# Altium schematic sheet Sheet_1.schdoc
size 328 x 230 mm
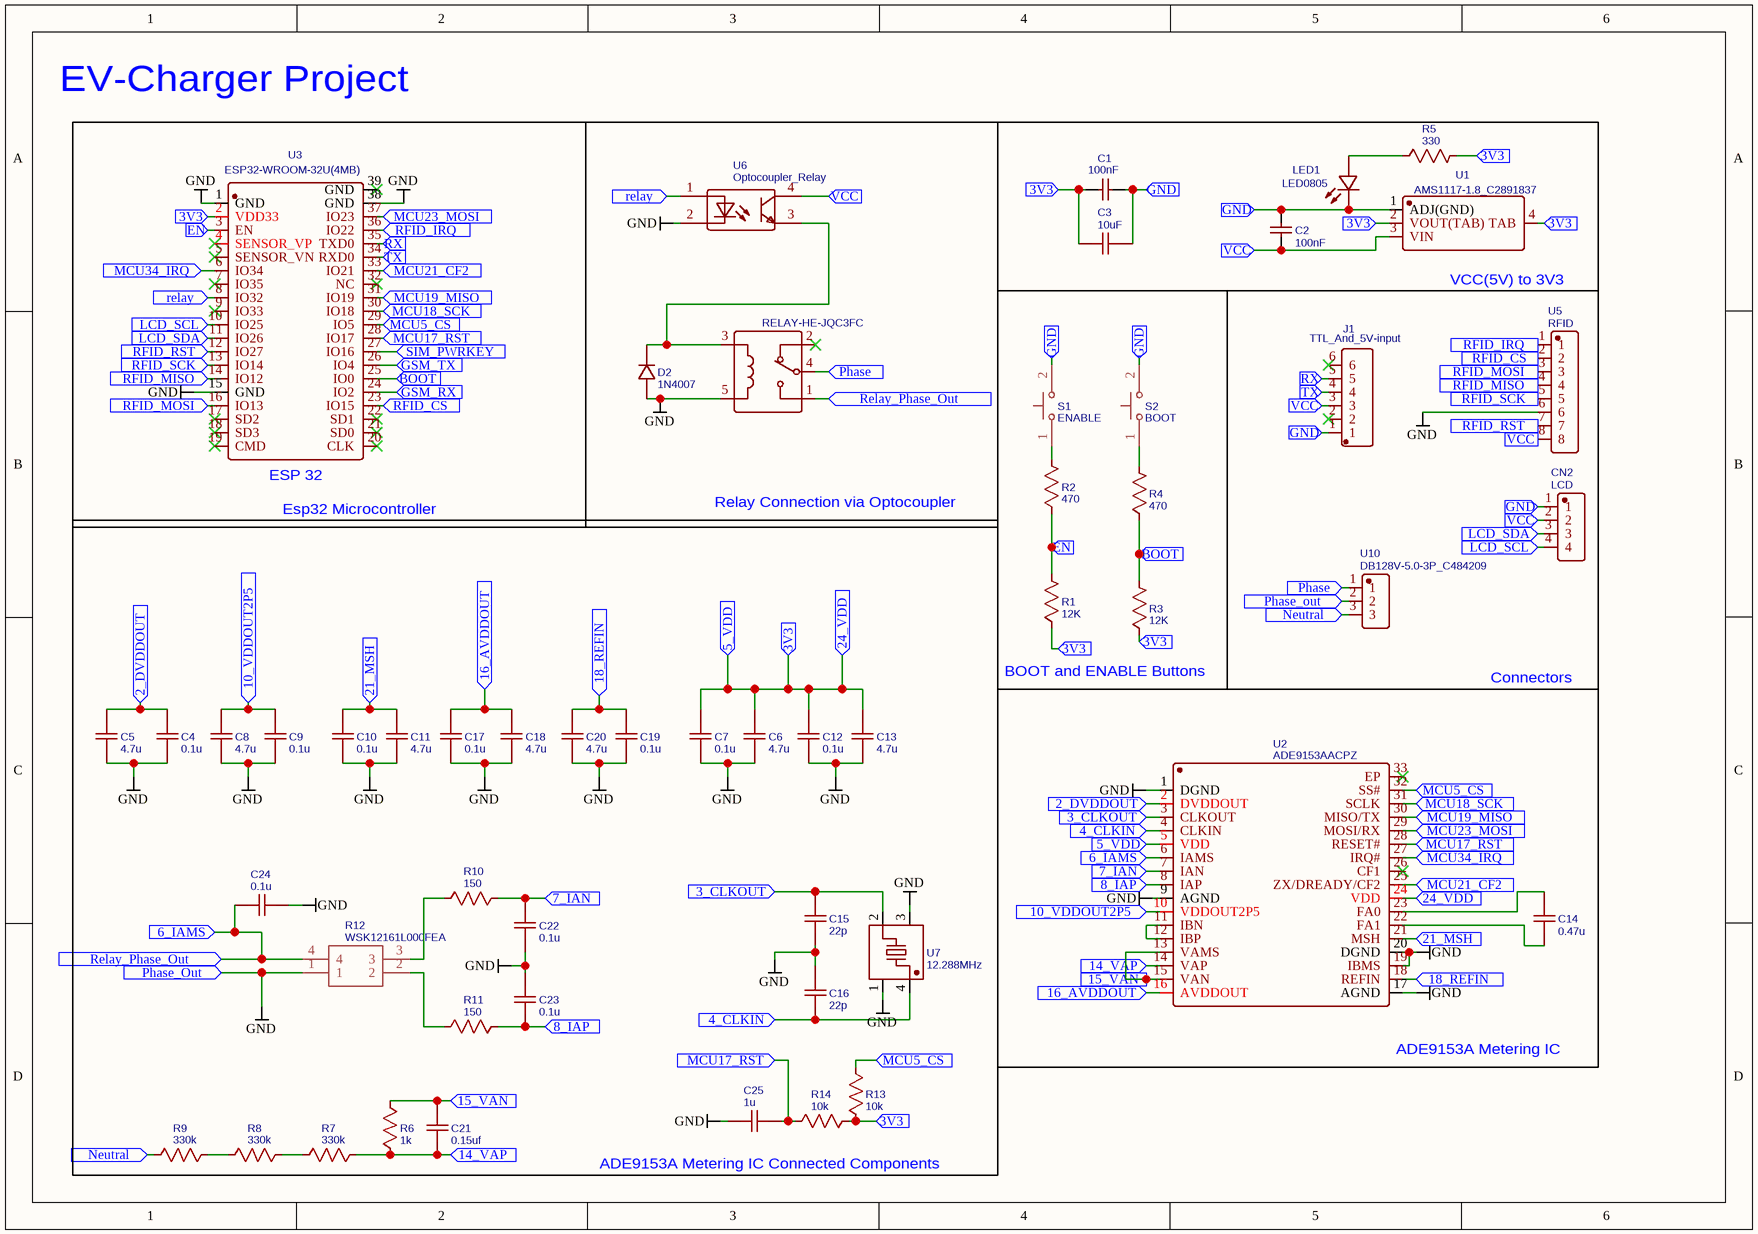
[diagram p0: Sheet_1.schdoc]

## Parts
2  RELAY-HE-JQC3FC  [RELAY-HE-JQC3FC]
C1  100nF  [CAP-TH_L7.2-W3.5-P5.00-D0.5]
C2  100nF  [CAP-TH_L7.2-W3.5-P5.00-D0.5]
C3  10uF  [C0805]
C4  0.1u  [C0805]
C5  4.7u  [C0805]
C6  4.7u  [C0805]
C7  0.1u  [C0805]
C8  4.7u  [C0805]
C9  0.1u  [C0805]
C10  0.1u  [C0805]
C11  4.7u  [C0805]
C12  0.1u  [C0805]
C13  4.7u  [C0805]
C14  0.47u  [C0805]
C15  22p  [C0805]
C16  22p  [C0805]
C17  0.1u  [C0805]
C18  4.7u  [C0805]
C19  0.1u  [C0805]
C20  4.7u  [C0805]
C21  0.15uf  [C0805]
C22  0.1u  [C0805]
C23  0.1u  [C0805]
C24  0.1u  [C0805]
C25  1u  [C0805]
CN2  LCD  [CONN-TH_XH-4A]
D2  1N4007  [DO-41_BD2.4-L4.7-P8.70-D0.9-RD]
J1  TTL_And_5V-input  [HDR-TH_6P-P2.54-H-M-W10.0]
LED1  LED0805  [LED0805-RD]
R1  12K  [RESISTOR SMD 0805]
R2  470  [RESISTOR SMD 0805]
R3  12K  [RESISTOR SMD 0805]
R4  470  [RESISTOR SMD 0805]
R5  330  [RESISTOR SMD 0805]
R6  1k  [R0805]
R7  330k  [R0805]
R8  330k  [R0805]
R9  330k  [R0805]
R10  150  [R0805]
R11  150  [R0805]
R12  WSK12161L000FEA  [WSK12161L000FEA]
R13  10k  [R0805]
R14  10k  [R0805]
S1  ENABLE  [SW_BUTT-2]
S2  BOOT  [SW_BUTT-2]
U1  AMS1117-1.8_C2891837  [SOT-223_L6.5-W3.5-P2.30-LS7.0-BR]
U2  ADE9153AACPZ  [LFCSP-32_L5.0-W5.0-P0.50-TL-EP3.6]
U3  ESP32-WROOM-32U(4MB)  [WIFI-SMD_ESP32-WROOM-32UE-A]
U5  RFID  [HDR-TH_8P-P2.54-V-F]
U6  Optocoupler_Relay  [SMD-4_L6.5-W4.6-P2.54-LS10.3-TL]
U7  12.288MHz  [CRYSTAL-SMD_4P-L5.0-W3.2-BL]
U10  DB128V-5.0-3P_C484209  [CONN-TH_3P-P5.00_DB128V-5.0-3P]

## Blocks framed on the sheet
Relay Connection via Optocoupler: 2 D2 U6
VCC(5V) to 3V3: C1-C3 LED1 R5 U1
BOOT and ENABLE Buttons: R1-R4 S1 S2
Connectors: CN2 J1 U5 U10
ADE9153A Metering IC: C14 U2

## Ports
2_DVDDOUT (in), 3_CLKOUT (in), 3V3 (in), 4_CLKIN (in), 5_VDD (in), 6_IAMS (in), 7_IAN (in), 8_IAP (in), 10_VDDOUT2P5 (in), 14_VAP (in), 15_VAN (in), 16_AVDDOUT (in), 18_REFIN (in), 21_MSH (in), 24_VDD (in), BOOT (in), EN (in), GND (in), GSM_RX (in), GSM_TX (in), LCD_SCL (in), LCD_SDA (in), MCU5_CS (in), MCU17_RST (in), MCU18_SCK (in), MCU19_MISO (in), MCU21_CF2 (in), MCU23_MOSI (in), MCU34_IRQ (in), Neutral (in), Phase (in), Phase_Out (in), Phase_out (in), relay (in), Relay_Phase_Out (in), RFID_CS (in), RFID_IRQ (in), RFID_MISO (in), RFID_MOSI (in), RFID_RST (in), RFID_SCK (in), RX (in), SIM_PWRKEY (in), TX (in), VCC (in)

## Nets
GND: 2.5 C4.2 C5.1 C6.1 C7.1 C8.1 C9.1 C10.1 C11.1 C12.1 C13.1 C15.1 C16.2 C17.1 C18.1 C19.2 C20.2 C22.1 C23.2 C24.1 C25.1 D2.2 R12.1 U2.1(DGND) U2.9(AGND) U2.17(AGND) U2.19(IBMS) U2.20(DGND) U3.1(GND) U3.15(GND) U3.38(GND) U5.6 U6.2 U7.1(GND) U7.3(GND) U10.2 ; port Phase_Out, port Phase_out
2_DVDDOUT: C4.1 C5.2 U2.2(DVDDOUT) ; port 2_DVDDOUT
3_CLKOUT: C15.2 U2.3(CLKOUT) U7.2 ; port 3_CLKOUT
4_CLKIN: C16.1 U2.4(CLKIN) U7.4 ; port 4_CLKIN
6_IAMS: 2.1 C24.2 R12.4 U2.6(IAMS) ; port 6_IAMS, port Relay_Phase_Out
7_IAN: C22.2 R10.2 U2.7(IAN) ; port 7_IAN
8_IAP: C23.1 R11.2 U2.8(IAP) ; port 8_IAP
10_VDDOUT2P5: C8.2 C9.2 U2.10(VDDOUT2P5) ; port 10_VDDOUT2P5
14_VAP: C21.1 R6.1 R7.1 U2.14(VAP) ; port 14_VAP
15_VAN: C21.2 R6.2 U2.13(VAMS) U2.15(VAN) ; port 15_VAN
16_AVDDOUT: C17.2 C18.2 U2.16(AVDDOUT) ; port 16_AVDDOUT
18_REFIN: C19.1 C20.1 U2.18(REFIN) ; port 18_REFIN
21_MSH: C10.2 C11.2 U2.21(MSH) ; port 21_MSH
24_VDD: C1.1 C3.1 C6.2 C7.2 C12.2 C13.2 R1.1 R3.1 R5.2 R13.2 R14.2 U1.2(VOUT(TAB)) U1.4(TAB) U2.5(VDD) U2.24(VDD) U3.2(VDD33) ; port 3V3, port 5_VDD, port 24_VDD
BOOT: R3.2 R4.1 U3.25(IO0) ; port BOOT
EN: R1.2 R2.1 U3.3(EN) ; port EN
GND: C1.2 C2.1 C3.2 CN2.1 J1.1 LED1.1(-) S1.2 S2.2 U1.1(ADJ(GND)) ; port GND  [a separate net that carries the same name]
GSM_RX: U3.24(IO2) ; port GSM_RX
GSM_TX: U3.26(IO4) ; port GSM_TX
LCD_SCL: CN2.4 U3.10(IO25) ; port LCD_SCL
LCD_SDA: CN2.3 U3.11(IO26) ; port LCD_SDA
MCU5_CS: R13.1 U2.32(SS#) U3.29(IO5) ; port MCU5_CS
MCU17_RST: C25.2 R14.1 U2.28(RESET#) U3.28(IO17) ; port MCU17_RST
MCU18_SCK: U2.31(SCLK) U3.30(IO18) ; port MCU18_SCK
MCU19_MISO: U2.30(MISO/TX) U3.31(IO19) ; port MCU19_MISO
MCU21_CF2: U2.25(ZX/DREADY/CF2) U3.33(IO21) ; port MCU21_CF2
MCU23_MOSI: U2.29(MOSI/RX) U3.37(IO23) ; port MCU23_MOSI
MCU34_IRQ: U2.27(IRQ#) U3.6(IO34) ; port MCU34_IRQ
Neutral: R9.2 U10.3 ; port Neutral
Phase: 2.4 U10.1 ; port Phase
relay: U3.8(IO32) U6.1 ; port relay
RFID_CS: U3.23(IO15) U5.2 ; port RFID_CS
RFID_IRQ: U3.36(IO22) U5.1 ; port RFID_IRQ
RFID_MISO: U3.14(IO12) U5.4 ; port RFID_MISO
RFID_MOSI: U3.16(IO13) U5.3 ; port RFID_MOSI
RFID_RST: U3.12(IO27) U5.7 ; port RFID_RST
RFID_SCK: U3.13(IO14) U5.5 ; port RFID_SCK
RX: J1.5 U3.35(TXD0) ; port RX
SIM_PWRKEY: U3.27(IO16) ; port SIM_PWRKEY
TX: J1.4 U3.34(RXD0) ; port TX
VCC: C2.2 CN2.2 J1.3 U1.3(VIN) U5.8 U6.4 ; port VCC
Net2_3: 2.3 D2.1 U6.3
NetC14_1: C14.1 U2.22(FA1)
NetC14_2: C14.2 U2.23(FA0)
NetLED1_2: LED1.2(+) R5.1
NetR2_2: R2.2 S1.1
NetR4_2: R4.2 S2.1
NetR7_2: R7.2 R8.1
NetR8_2: R8.2 R9.1
NetR10_1: R10.1 R12.3
NetR11_1: R11.1 R12.2
NetU2_11: U2.11(IBN) U2.12(IBP)

Not connected (* = marked no-connect by the designer): 2 2(1)*; J1 2* 6*; U2 26(CF1)* 33(EP)*; U3 4(SENSOR_VP)* 5(SENSOR_VN)* 7(IO35)* 9(IO33)* 17(SD2)* 18(SD3)* 19(CMD)* 20(CLK)* 21(SD0)* 22(SD1)* 32(NC)* 39(GND)*

## Notes on the sheet
- EV-Charger Project
- (near U3) ESP 32
- Esp32 Microcontroller
- ADE9153A Metering IC Connected Components

## Library data of the parts
2 = RELAY-HE-JQC3FC: Contributor: pratikandhale01; BOM_Manufacturer Part: RELAY-HE-JQC3FC; spicePre: K; spiceSymbolName: RELAY-HE-JQC3FC
C1 C2 = 100nF: BOM_Manufacturer: ReliaPro; BOM_Manufacturer Part: Calibration capacitor100nF（104）100V,5%; nameAlias: Value; BOM_Supplier: LCSC; BOM_Supplier Part: C26609; spicePre: C; spiceSymbolName: Calibration capacitor100nF（104）100V,5%
C3 = 10uF: BOM_Manufacturer: Samwha Capacitor; BOM_Manufacturer Part: CS2012X7R105K500NRE; nameAlias: Capacitance; Contributor: LCSC; BOM_Supplier: LCSC; BOM_Supplier Part: C516002; BOM_JLCPCB Part Class: Extended Part; spicePre: C; spiceSymbolName: CS2012X7R105K500NRE
C4 C7 C9 C10 C12 C17 C19 C22-C24 = 0.1u: nameAlias: Value(F); Contributor: LCEDA_Lib; spicePre: C; spiceSymbolName: C_0805_US
C5 C6 C8 C11 C13 C18 C20 = 4.7u: nameAlias: Value(F); Contributor: LCEDA_Lib; spicePre: C; spiceSymbolName: C_0805_US
C14 = 0.47u: nameAlias: Value(F); Contributor: LCEDA_Lib; spicePre: C; spiceSymbolName: C_0805_US
C15 C16 = 22p: nameAlias: Value(F); Contributor: LCEDA_Lib; spicePre: C; spiceSymbolName: C_0805_US
C21 = 0.15uf: nameAlias: Value(F); Contributor: LCEDA_Lib; spicePre: C; spiceSymbolName: C_0805_US
C25 = 1u: nameAlias: Value(F); Contributor: LCEDA_Lib; spicePre: C; spiceSymbolName: C_0805_US
CN2 = LCD: BOM_Manufacturer: null; BOM_Manufacturer Part: Header 4; Contributor: lcsc; BOM_Supplier: LCSC; BOM_Supplier Part: C9900017655; BOM_JLCPCB Part Class: Extended Part; spicePre: C; spiceSymbolName: HEADER 4
D2 = 1N4007: BOM_Manufacturer: SEMTECH; Contributor: LCEDA_Lib; BOM_Supplier: LCSC; BOM_Manufacturer Part: 1N4007; BOM_Supplier Part: C106903; spicePre: D; spiceSymbolName: 1N4007
J1 = TTL_And_5V-input: BOM_Manufacturer: BOOMELE; BOM_Manufacturer Part: 2.54-1*6PHeader; spicePre: X; BOM_Supplier: LCSC; BOM_Supplier Part: C56816; BOM_JLCPCB Part Class: Extended Part; spiceSymbolName: 2.54-1*6PHeader-RA
LED1 = LED0805: BOM_Manufacturer: null; Contributor: LCSC; BOM_Supplier: LCSC; BOM_Supplier Part: C9900012722; BOM_Manufacturer Part: led0805; BOM_JLCPCB Part Class: Extended Part; spicePre: L; spiceSymbolName: LED0805
R1 = 12K: Contributor: Marek Štafl; spicePre: R; spiceSymbolName: Resistor SMD 0805
R2 R4 = 470: Contributor: Marek Štafl; Package Display: No; spicePre: R; spiceSymbolName: Resistor SMD 0805
R3 = 12K: Contributor: Marek Štafl; Package Display: No; spicePre: R; spiceSymbolName: Resistor SMD 0805
R5 = 330: Contributor: Marek Štafl; spicePre: R; spiceSymbolName: Resistor SMD 0805
R6 = 1k: nameAlias: Value(Ω); Contributor: LCEDA_Lib; spicePre: R; spiceSymbolName: R_0805_US
R7-R9 = 330k: nameAlias: Value(Ω); Contributor: LCEDA_Lib; spicePre: R; spiceSymbolName: R_0805_US
R10 R11 = 150: nameAlias: Value(Ω); Contributor: LCEDA_Lib; spicePre: R; spiceSymbolName: R_0805_US
R12 = WSK12161L000FEA: Contributor: e3bble; spicePre: R; spiceSymbolName: WSK12161L000FEA
R13 R14 = 10k: nameAlias: Value(Ω); Contributor: LCEDA_Lib; spicePre: R; spiceSymbolName: R_0805_US
S1 = ENABLE: Contributor: premchandg278; spicePre: S; spiceSymbolName: BUTT-2
S2 = BOOT: Contributor: premchandg278; spicePre: S; spiceSymbolName: BUTT-2
U1 = AMS1117-1.8_C2891837: BOM_Manufacturer: YONGYUTAI(永裕泰); Contributor: LCSC; BOM_Supplier: LCSC; BOM_Supplier Part: C2891837; BOM_Manufacturer Part: AMS1117-1.8; BOM_JLCPCB Part Class: Extended Part; spicePre: U; spiceSymbolName: AMS1117-1.8_C2891837
U2 = ADE9153AACPZ: BOM_Manufacturer: ADI(亚德诺)/LINEAR(凌特); Contributor: LCSC; BOM_Supplier: LCSC; BOM_Supplier Part: C654560; BOM_Manufacturer Part: ADE9153AACPZ; link: https://atta.szlcsc.comnull; BOM_JLCPCB Part Class: Extended Part; spicePre: U; spiceSymbolName: ADE9153AACPZ
U3 = ESP32-WROOM-32U(4MB): BOM_Manufacturer: ESPRESSIF(乐鑫); BOM_Manufacturer Part: ESP32-WROOM-32U-N4; Contributor: LCSC; BOM_Supplier: LCSC; BOM_Supplier Part: C2934572; BOM_JLCPCB Part Class: Extended Part; spicePre: U; spiceSymbolName: ESP32-WROOM-32U(4MB)
U5 = RFID: BOM_Manufacturer: null; BOM_Manufacturer Part: 8Pin排母,间距2.54mm,高5.0mm; Contributor: lcsc; BOM_Supplier: LCSC; BOM_Supplier Part: C9900020870; BOM_JLCPCB Part Class: Extended Part; spicePre: U; spiceSymbolName: 8PIN排母,间距2.54MM,高5.0MM
U6 = Optocoupler_Relay: BOM_Manufacturer: EVERLIGHT(台湾亿光); BOM_Manufacturer Part: EL817S1(A)(TU)-FV; Contributor: lcsc; BOM_Supplier: LCSC; BOM_Supplier Part: C3031553; link: https://atta.szlcsc.com/upload/public/pdf/source/20190822/C414631_C7A1B3593B8F2C5CC80A400A5F6957FA.pdf; spicePre: U; spiceSymbolName: EL817S1(A)(TU)-FV
U7 = 12.288MHz: BOM_Manufacturer: ABRACON; BOM_Manufacturer Part: ABM3C-12.288MHZ-D4Y-T; Contributor: LCSC; nameAlias: Frequency; BOM_Supplier: LCSC; BOM_Supplier Part: C1985504; BOM_JLCPCB Part Class: Extended Part; spicePre: U; spiceSymbolName: ABM3C-12.288MHZ-D4Y-T
U10 = DB128V-5.0-3P_C484209: BOM_Manufacturer: DIBO(地博电气); BOM_Manufacturer Part: DB128V-5.0-3P-GN-S; Contributor: LCSC; BOM_Supplier: LCSC; BOM_Supplier Part: C484209; BOM_JLCPCB Part Class: Extended Part; spicePre: U; spiceSymbolName: DB128V-5.0-3P_C484209